# Altium schematic sheet FFC-STDC14-adapter.SchDoc
size A4
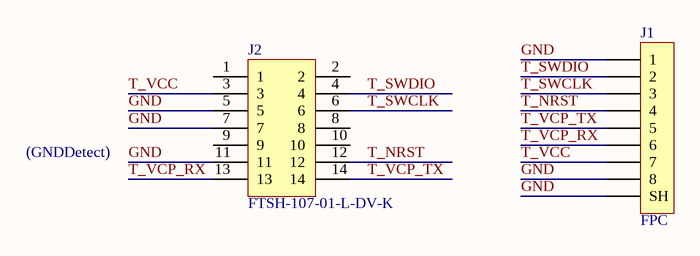
[diagram p0: FFC-STDC14-adapter.SchDoc]

## Parts
J1  FPC  [HIROSE-FH19C-8S-0.5SH]
J2  FTSH-107-01-L-DV-K  [FTSH-107-01-L-DV-K]

## Nets
GND: J1.1 J1.8 J1.SH J2.5 J2.7 J2.11
T_NRST: J1.4 J2.12
T_SWCLK: J1.3 J2.6
T_SWDIO: J1.2 J2.4
T_VCC: J1.7 J2.3
T_VCP_RX: J1.6 J2.13
T_VCP_TX: J1.5 J2.14

Not connected (* = marked no-connect by the designer): J2 1 2 8 9 10

## Notes on the sheet
- (GNDDetect)

## Library data of the parts
J1 = FPC-CONNECTOR-8